# Altium project Fighter.PrjPcb
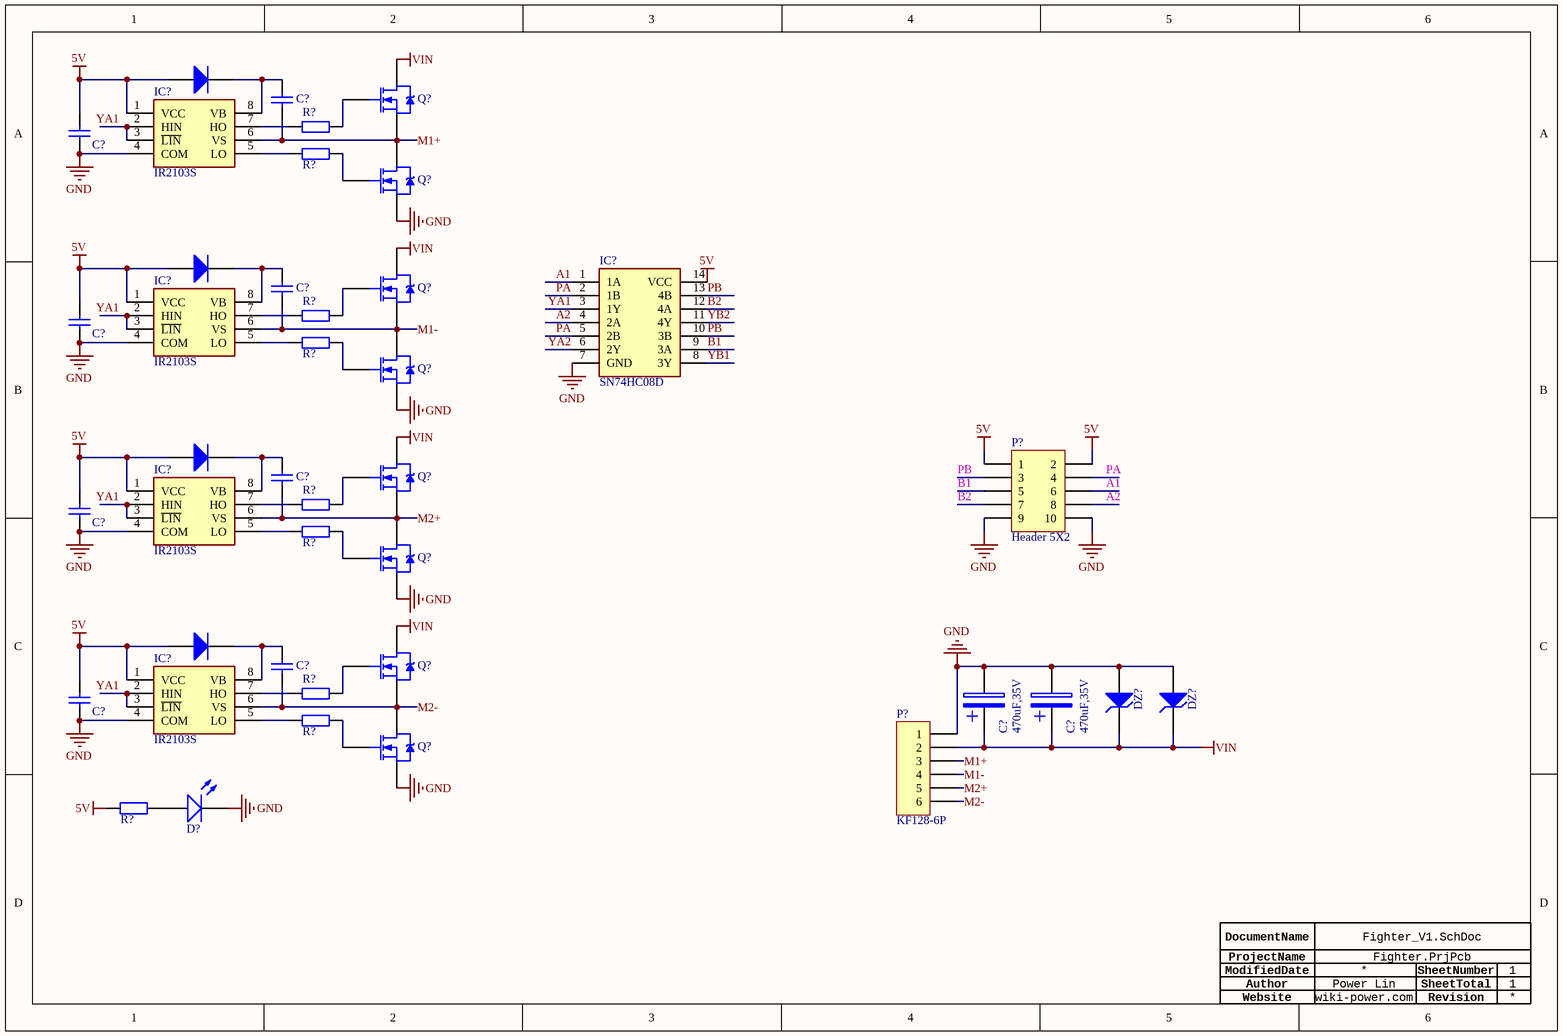
[diagram p0: Fighter_V1.SchDoc]
1 sheet, 41 parts. Net scope: global (net labels, ports and power ports of the same name join across sheets).
Board file: Fighter_V1.0.PcbDoc

## Sheet Fighter_V1.SchDoc
size 292 x 193 mm; Author: Power Lin; SheetNumber: 1; SheetTotal: 1; Website: wiki-power.com

### Parts
(Parts that share a designator on the sheet are numbered #1, #2 ... from top to bottom, then left to right.)
C?#1  1uF  [CAP-1206]  (value not drawn)
C?#2  100nF  [CAP-0603]  (value not drawn)
C?#3  1uF  [CAP-1206]  (value not drawn)
C?#4  100nF  [CAP-0603]  (value not drawn)
C?#5  1uF  [CAP-1206]  (value not drawn)
C?#6  100nF  [CAP-0603]  (value not drawn)
C?#7  1uF  [CAP-1206]  (value not drawn)
C?#8  470uF,35V  [贴片固态电容10*10.2]
C?#9  470uF,35V  [贴片固态电容10*10.2]
C?#10  100nF  [CAP-0603]  (value not drawn)
D?#1  0805  [D0805]  (value not drawn)
D?#2  0805  [D0805]  (value not drawn)
D?#3  0805  [D0805]  (value not drawn)
D?#4  0805  [D0805]  (value not drawn)
D?#5  RED  [LED-0603]  (value not drawn)
DZ?#1  (no value)  [D2512]
DZ?#2  (no value)  [D2512]
IC?#1  IR2103S  [SOIC_8]
IC?#2  SN74HC08D  [SOIC_14]
IC?#3  IR2103S  [SOIC_8]
IC?#4  IR2103S  [SOIC_8]
IC?#5  IR2103S  [SOIC_8]
P?#1  Header 5X2  [HDR2X5]
P?#2  KF128-6P  [KF128-6P]
Q?#1  IRLR7843  [TO-252]  (value not drawn)
Q?#2  IRLR7843  [TO-252]  (value not drawn)
Q?#3  IRLR7843  [TO-252]  (value not drawn)
Q?#4  IRLR7843  [TO-252]  (value not drawn)
Q?#5  IRLR7843  [TO-252]  (value not drawn)
Q?#6  IRLR7843  [TO-252]  (value not drawn)
Q?#7  IRLR7843  [TO-252]  (value not drawn)
Q?#8  IRLR7843  [TO-252]  (value not drawn)
R?#1  10R  [R-0603]  (value not drawn)
R?#2  10R  [R-0603]  (value not drawn)
R?#3  10R  [R-0603]  (value not drawn)
R?#4  10R  [R-0603]  (value not drawn)
R?#5  10R  [R-0603]  (value not drawn)
R?#6  10R  [R-0603]  (value not drawn)
R?#7  10R  [R-0603]  (value not drawn)
R?#8  10R  [R-0603]  (value not drawn)
R?#9  10k  [R-0603]  (value not drawn)

### Nets
5V: C?#2.2 C?#4.2 C?#6.2 C?#10.2 D?#1.1(A) D?#2.1(A) D?#3.1(A) D?#4.1(A) IC?#1.1(VCC) IC?#2.14(VCC) IC?#3.1(VCC) IC?#4.1(VCC) IC?#5.1(VCC) P?#1.1 P?#1.2 R?#9.1
GND: C?#2.1 C?#4.1 C?#6.1 C?#8.2 C?#9.2 C?#10.1 D?#5.K DZ?#1.1(A) DZ?#2.1(A) IC?#1.4(COM) IC?#2.7(GND) IC?#3.4(COM) IC?#4.4(COM) IC?#5.4(COM) P?#1.9 P?#1.10 P?#2.1 Q?#2.3(S) Q?#4.3(S) Q?#6.3(S) Q?#8.3(S)
VIN: C?#8.1 C?#9.1 DZ?#1.2(K) DZ?#2.2(K) P?#2.2 Q?#1.4(D) Q?#3.4(D) Q?#5.4(D) Q?#7.4(D)
A1: IC?#2.1(1A) P?#1.6
A2: IC?#2.4(2A) P?#1.8
B1: IC?#2.9(3A) P?#1.5
B2: IC?#2.12(4A) P?#1.7
M1+: C?#1.2 IC?#1.6(VS) P?#2.3 Q?#1.3(S) Q?#2.4(D)
M1-: C?#3.2 IC?#3.6(VS) P?#2.4 Q?#3.3(S) Q?#4.4(D)
M2+: C?#5.2 IC?#4.6(VS) P?#2.5 Q?#5.3(S) Q?#6.4(D)
M2-: C?#7.2 IC?#5.6(VS) P?#2.6 Q?#7.3(S) Q?#8.4(D)
PA: IC?#2.2(1B) IC?#2.5(2B) P?#1.4
PB: IC?#2.10(3B) IC?#2.13(4B) P?#1.3
YA1: IC?#1.2(HIN) IC?#1.3(~{LIN}) IC?#2.3(1Y) IC?#3.2(HIN) IC?#3.3(~{LIN}) IC?#4.2(HIN) IC?#4.3(~{LIN}) IC?#5.2(HIN) IC?#5.3(~{LIN})
YA2: IC?#2.6(2Y)
YB1: IC?#2.8(3Y)
YB2: IC?#2.11(4Y)
NetC?#1_1: C?#1.1 D?#1.2(K) IC?#1.8(VB)
NetC?#3_1: C?#3.1 D?#2.2(K) IC?#3.8(VB)
NetC?#5_1: C?#5.1 D?#3.2(K) IC?#4.8(VB)
NetC?#7_1: C?#7.1 D?#4.2(K) IC?#5.8(VB)
NetD?#5_A: D?#5.A R?#9.2
NetIC?#1_5: IC?#1.5(LO) R?#2.1
NetIC?#1_7: IC?#1.7(HO) R?#1.1
NetIC?#3_5: IC?#3.5(LO) R?#4.1
NetIC?#3_7: IC?#3.7(HO) R?#3.1
NetIC?#4_5: IC?#4.5(LO) R?#6.1
NetIC?#4_7: IC?#4.7(HO) R?#5.1
NetIC?#5_5: IC?#5.5(LO) R?#8.1
NetIC?#5_7: IC?#5.7(HO) R?#7.1
NetQ?#1_1: Q?#1.1(G) R?#1.2
NetQ?#2_1: Q?#2.1(G) R?#2.2
NetQ?#3_1: Q?#3.1(G) R?#3.2
NetQ?#4_1: Q?#4.1(G) R?#4.2
NetQ?#5_1: Q?#5.1(G) R?#5.2
NetQ?#6_1: Q?#6.1(G) R?#6.2
NetQ?#7_1: Q?#7.1(G) R?#7.2
NetQ?#8_1: Q?#8.1(G) R?#8.2

### Notes on the sheet
- Author
- DocumentName
- ModifiedDate
- ProjectName
- SheetNumber
- SheetTotal
- Website
- Revision
- (in symbol CAP1) +

### Library data of the parts
C?#1-C?#7 C?#10 = CAP: 贴片电容; ComponentLink1Description: 供应商链接; ComponentLink1URL: http://www.szlcsc.com/product/details_53938.html; Package: 0402; Supplier: LC; SuppliersPartNumber: C52923
C?#8 C?#9 = CAP1: 电解电容
D?#1-D?#4 = Diode: Default Diode
D?#5 = LED: 发光二极管; pin to pad: A>1 K>2; ComponentLink1Description: 供应商链接; ComponentLink1URL: http://www.szlcsc.com/product/details_2663.html; Package: 0603; Supplier: LC; SuppliersPartNumber: C2290
DZ?#1 DZ?#2 = D Zener
IC?#1 IC?#3-IC?#5 = IR2103S: Integrated Circuit; Manufacturer_Name: International Rectifier; Manufacturer_Part_Number: IR2103SPBF; Datasheet Link: https://www.infineon.com/dgdl/ir2103.pdf?fileId=5546d462533600a4015355c7b54b166f; Height: 1.75mm
IC?#2 = SN74HC08D: Integrated Circuit; Manufacturer_Name: Texas Instruments; Datasheet Link: http://docs-emea.rs-online.com/webdocs/0b80/0900766b80b80bbb.pdf; Height: 1.75mm; Manufacturer_Part_Number: SN74HC08D; Arrow Part Number: SN74HC08D; Arrow Price/Stock: https://www.arrow.com/en/products/sn74hc08d/texas-instruments; Mouser Part Number: 595-SN74HC08D; Mouser Price/Stock: https://www.mouser.co.uk/ProductDetail/Texas-Instruments/SN74HC08D?qs=st7IWvlL5%2FjpJg0KgrS5HQ%3D%3D
P?#1 = Header 5X2: Header, 5-Pin, Dual row; LatestRevisionDate: 17-Jul-2002; LatestRevisionNote: Re-released for DXP Platform.; Publisher: Altium Limited
P?#2 = Header6
Q?#1-Q?#8 = IRLR7843: HEXFET Power MOSFET; Note: Pin 2 is trimmed and is electrically connected to Drain.; Published: 8-Jun-2000; LatestRevisionDate: 20-Nov-2009; LatestRevisionNote: IPC-7351 Footprint Added.; DatasheetVersion: PD-91318B; PackageVersion: Feb-2003; PackageReference: TO-252AA; Publisher: Altium Limited; PackageDescription: 3-Pin HEXFET Package 2.28 mm Pitch, 9.9 mm Lead Span; Code_JEDEC: TO-252-AA; ComponentLink1Description: Manufacturer Link; ComponentLink1URL: http://www.irf.com/; ComponentLink2Description: Datasheet; ComponentLink2URL: http://www.irf.com/product-info/datasheets/data/irfr1205.pdf
R?#1-R?#9 = RES: 贴片电阻; Package: 0805; Supplier: LC; SuppliersPartNumber: C17798